# EAGLE design S4QX11 (EAGLE 7.5.0)
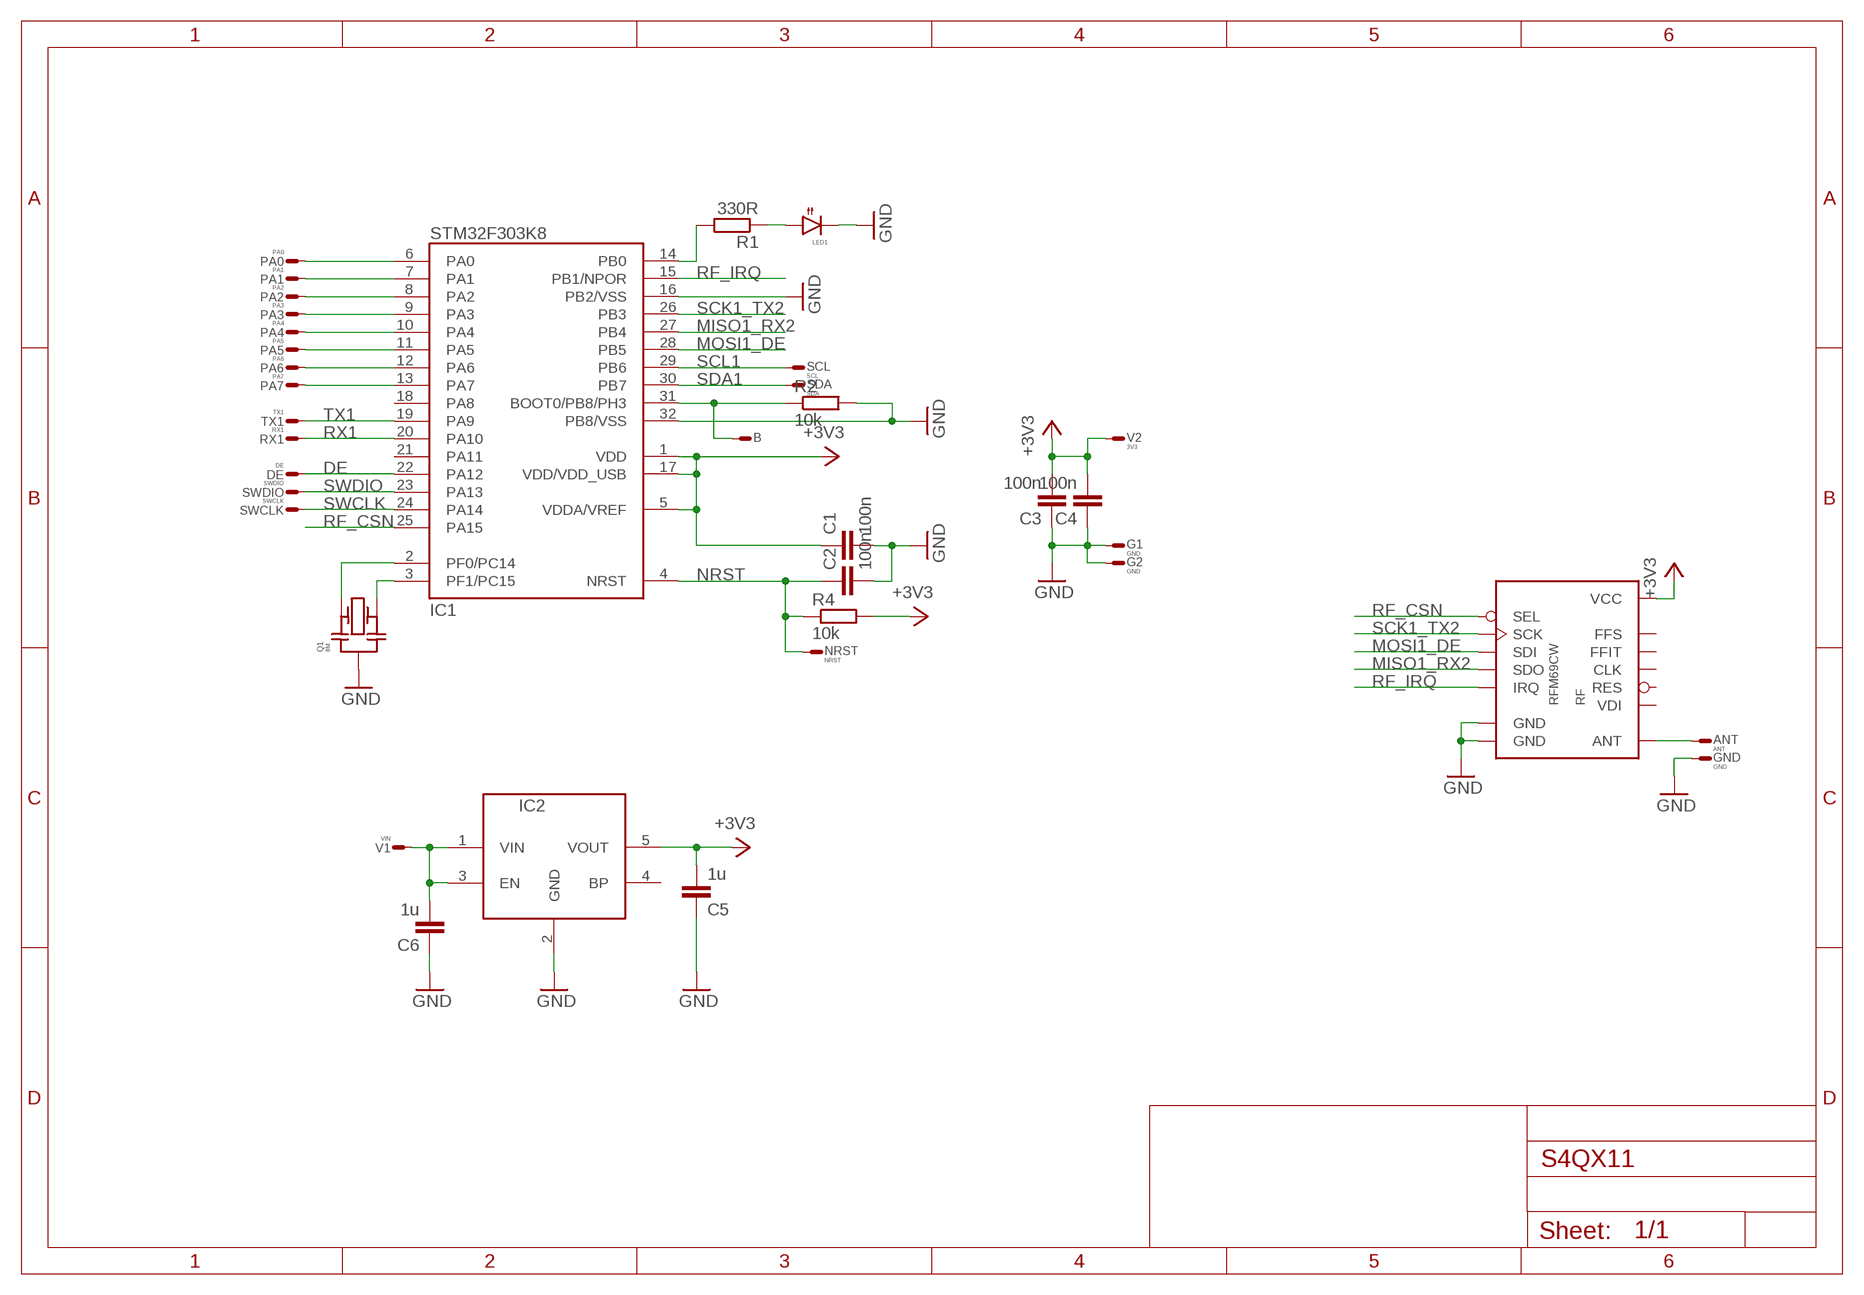
[diagram p0: schematic, sheet 1]

## Parts
ANT  ANT  WIREPADT1.6/0.9  [T1.6/0.9]
B  WIREPADR  [S1.27R]
C1  100n  C0603  [0603]
C2  100n  C0603  [0603]
C3  100n  C0603  [0603]
C4  100n  C0603  [0603]
C5  1u  C0603  [0603]
C6  1u  C0603  [0603]
DE  DE  WIREPADT1.6/0.9  [T1.6/0.9]
G1  GND  WIREPADT1.6/0.9  [T1.6/0.9]
G2  GND  WIREPADT1.6/0.9  [T1.6/0.9]
GND  GND  WIREPADT1.6/0.9  [T1.6/0.9]
IC1  STM32F303K8  STM32_LQFP32  [LQFP32-7X7]
IC2  LDO  [SOT23-5]
LED1  LED1206  [1206]
NRST  NRST  WIREPADT1.6/0.9  [T1.6/0.9]
PA0  PA0  WIREPADT1.6/0.9  [T1.6/0.9]
PA1  PA1  WIREPADT1.6/0.9  [T1.6/0.9]
PA2  PA2  WIREPADT1.6/0.9  [T1.6/0.9]
PA3  PA3  WIREPADT1.6/0.9  [T1.6/0.9]
PA4  PA4  WIREPADT1.6/0.9  [T1.6/0.9]
PA5  PA5  WIREPADT1.6/0.9  [T1.6/0.9]
PA6  PA6  WIREPADT1.6/0.9  [T1.6/0.9]
PA7  PA7  WIREPADT1.6/0.9  [T1.6/0.9]
Q1  8M  QRCE  [CSTCE]
R1  330R  R0603  [0603]
R2  10k  R0603  [0603]
R4  10k  R0603  [0603]
RF  RFM69CW  RFM12B-868-S1  [RFM12B]
RX1  RX1  WIREPADT1.6/0.9  [T1.6/0.9]
SCL  SCL  WIREPADT1.6/0.9  [T1.6/0.9]
SDA  SDA  WIREPADT1.6/0.9  [T1.6/0.9]
SWCLK  SWCLK  WIREPADT1.6/0.9  [T1.6/0.9]
SWDIO  SWDIO  WIREPADT1.6/0.9  [T1.6/0.9]
TX1  TX1  WIREPADT1.6/0.9  [T1.6/0.9]
V1  VIN  WIREPADT1.6/0.9  [T1.6/0.9]
V2  3V3  WIREPADT1.6/0.9  [T1.6/0.9]

## Nets
+3V3: C1.1 C3.2 C4.2 C5.2 IC1.1(VDD) IC1.5(VDDA/VREF) IC1.17(VDD/VDD_USB) IC2.5(VOUT) R4.2 RF.VDD(VCC) V2.1(S)
DE: DE.1(S) IC1.22(PA12)
GND: C1.2 C2.2 C3.1 C4.1 C5.1 C6.1 G1.1(S) G2.1(S) GND.1(S) IC1.16(PB2/VSS) IC1.32(PB8/VSS) IC2.2(GND) LED1.2(C) Q1.G(M) R2.2 RF.GND RF.GND@1(GND)
MISO1_RX2: IC1.27(PB4) RF.SDO
MOSI1_DE: IC1.28(PB5) RF.SDI
N$1: ANT.1(S) RF.ANT
N$2: IC1.3(PF1/PC15) Q1.B
N$3: IC1.6(PA0) PA0.1(S)
N$4: B.1(S) IC1.31(BOOT0/PB8/PH3) R2.1
N$5: IC1.2(PF0/PC14) Q1.A
N$6: IC1.7(PA1) PA1.1(S)
N$7: IC1.8(PA2) PA2.1(S)
N$8: IC1.9(PA3) PA3.1(S)
N$9: IC1.10(PA4) PA4.1(S)
N$10: IC1.11(PA5) PA5.1(S)
N$11: IC1.12(PA6) PA6.1(S)
N$12: IC1.13(PA7) PA7.1(S)
N$13: IC1.14(PB0) R1.2
N$14: LED1.1(A) R1.1
N$15: C6.2 IC2.1(VIN) IC2.3(EN) V1.1(S)
NRST: C2.1 IC1.4(NRST) NRST.1(S) R4.1
RF_CSN: IC1.25(PA15) RF.SEL
RF_IRQ: IC1.15(PB1/NPOR) RF.IRQ
RX1: IC1.20(PA10) RX1.1(S)
SCK1_TX2: IC1.26(PB3) RF.SCK
SCL1: IC1.29(PB6) SCL.1(S)
SDA1: IC1.30(PB7) SDA.1(S)
SWCLK: IC1.24(PA14) SWCLK.1(S)
SWDIO: IC1.23(PA13) SWDIO.1(S)
TX1: IC1.19(PA9) TX1.1(S)
Unconnected: IC1.18(PA8) IC1.21(PA11) IC2.4(BP) RF./RES(RES) RF.CFIL(FFIT) RF.CLK RF.FFS RF.INT(VDI)

## Library data of the parts
ANT B DE G1 G2 GND NRST PA0 PA1-PA7 RX1 SCL SDA SWCLK SWDIO TX1 V1 V2 = Conn:WIREPAD: Wire PAD connect wire on PCB
C1-C6 = RCL:C: Capacitor SMD
IC1 = STM32:STM32_LQFP32
IC2 = DCDC:LDO
LED1 = Optic:LED
Q1 = QUARTZ:QR
R1 R2 R4 = RCL:R: Resistor SMD
RF = RF:RFM12B: 5dB Transceiver Module

## Board
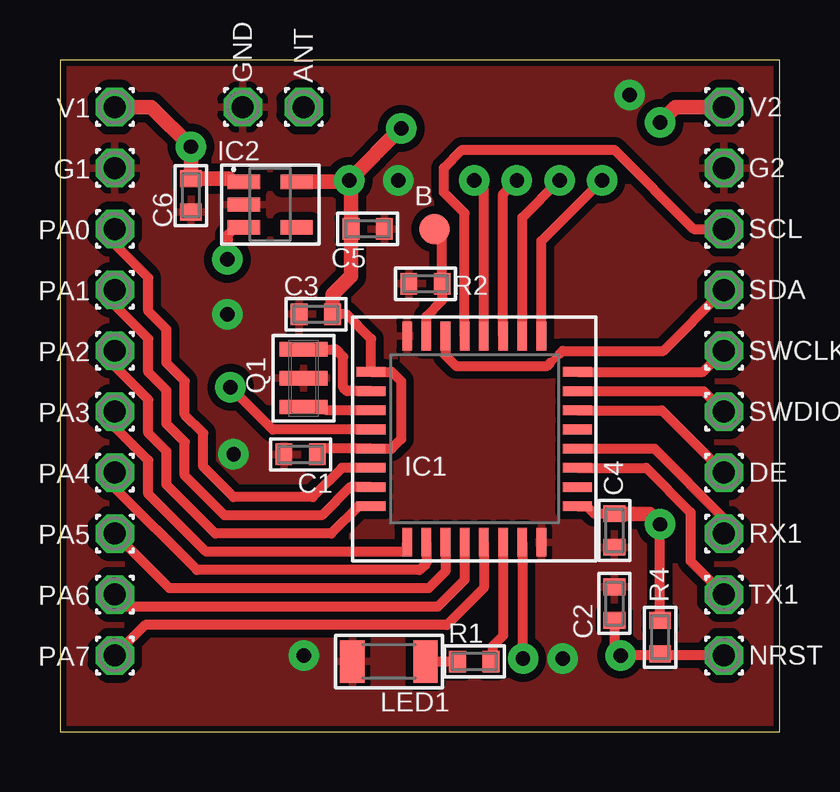
[diagram p1: board, top side]
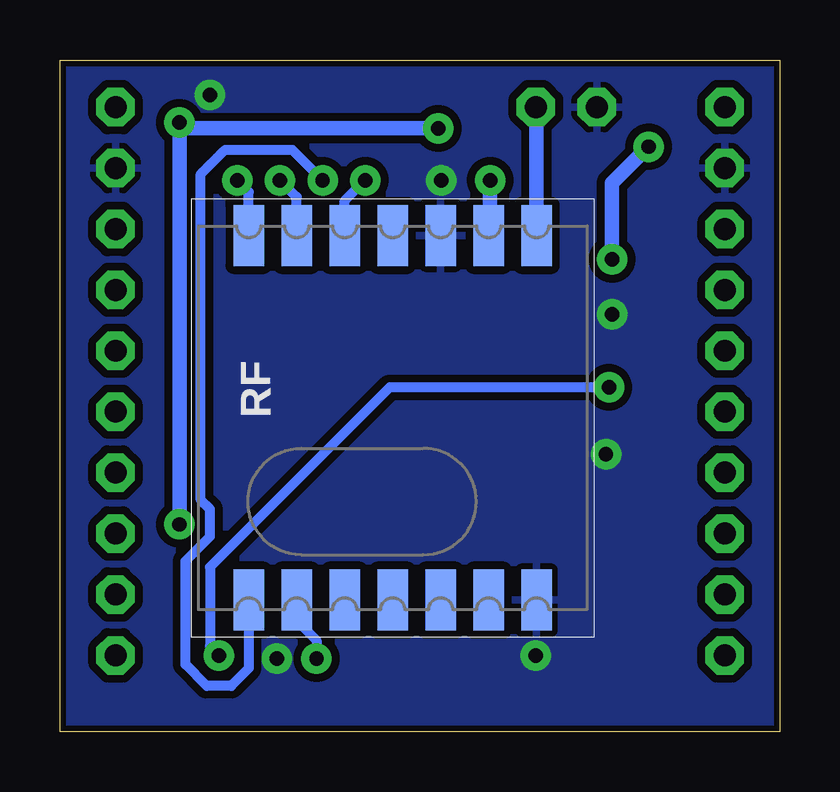
[diagram p2: board, bottom side, seen from below]

Size 30 x 28 mm. Coordinates in mm from the lower left corner, seen from the top.
Outline: 0,0 30,0 30,28 0,28 0,0
Copper layers (1*16): Top 0.035mm / dielectric 1.5mm / Bottom 0.035mm
Design rules "default *": minimum track width 12mil, minimum drill 12mil, track to track 13mil, track to pad 13mil, pad to pad 13mil, via to via 13mil, smd to smd 13mil, copper to edge 10mil, drill to drill 8mil, minimum pad ring 10mil, minimum via ring 8mil, stop-mask expansion 2mil, vias tented up to drill 24mil, thermal gap 10mil

### Footprints (pad centres in the part's own frame; a part is rotated, then mirrored left to right if it is on the bottom)
T1.6/0.9 = drill 0.914 pad 1.6 octagon: 1 0,0
S1.27R = smd 1.27 x 1.27: 1 0,0
0603 = smd 0.7 x 0.9: 1 -0.697,0; 2 0.697,0
LQFP32-7X7 = smd 1.2 x 0.4: 1 -4.3,2.8; 2 -4.3,2; 3 -4.3,1.2; 4 -4.3,0.4; 5 -4.3,-0.4; 6 -4.3,-1.2; 7 -4.3,-2; 8 -4.3,-2.8; 17 4.3,-2.8; 18 4.3,-2; 19 4.3,-1.2; 20 4.3,-0.4; 21 4.3,0.4; 22 4.3,1.2; 23 4.3,2; 24 4.3,2.8 | smd 0.4 x 1.2: 9 -2.8,-4.3; 10 -2,-4.3; 11 -1.2,-4.3; 12 -0.4,-4.3; 13 0.4,-4.3; 14 1.2,-4.3; 15 2,-4.3; 16 2.8,-4.3; 25 2.8,4.3; 26 2,4.3; 27 1.2,4.3; 28 0.4,4.3; 29 -0.4,4.3; 30 -1.2,4.3; 31 -2,4.3; 32 -2.8,4.3
SOT23-5 = smd 0.6 x 1.35: 1 -0.95,-1.101; 2 0,-1.101; 3 0.95,-1.101; 4 0.95,1.101; 5 -0.951,1.101
1206 = smd 1.016 x 1.778: 1 -1.524,0; 2 1.524,0
CSTCE = smd 0.6 x 2: A -1.2,0; B 1.2,0; G 0,0
RFM12B = smd 2.54 x 1.27: /RES -7.6,-4; ANT 7.6,-6; CFIL -7.6,0; CLK -7.6,-2; FFS -7.6,2; GND 7.6,-2; GND@1 -7.6,-6; INT 7.6,0; IRQ -7.6,4; SCK 7.6,4; SDI 7.6,2; SDO -7.6,6; SEL 7.6,6; VDD 7.6,-4

### Placement (x,y rotation side)
ANT  10.16,26.04 90 top
B  15.62,20.95 0 top
C1  10.03,11.56 180 top
C2  23.11,5.33 90 top
C3  10.67,17.4 0 top
C4  23.11,8.38 90 top
C5  12.83,20.95 180 top
C6  5.46,22.35 90 top
DE  27.69,10.79 0 top
G1  2.29,23.5 180 top
G2  27.69,23.5 0 top
GND  7.62,26.04 90 top
IC1  17.27,12.19 0 top
IC2  8.76,21.97 270 top
LED1  13.72,2.92 180 top
NRST  27.69,3.17 0 top
PA0  2.29,20.95 180 top
PA1  2.29,18.41 180 top
PA2  2.29,15.88 180 top
PA3  2.29,13.34 180 top
PA4  2.29,10.79 180 top
PA5  2.29,8.26 180 top
PA6  2.29,5.71 180 top
PA7  2.29,3.17 180 top
Q1  10.16,14.73 270 top
R1  17.27,2.92 0 top
R2  15.24,18.67 180 top
R4  25.02,3.94 90 top
RF  16.13,13.08 90 bottom
RX1  27.69,8.26 0 top
SCL  27.69,20.95 0 top
SDA  27.69,18.41 0 top
SWCLK  27.69,15.88 0 top
SWDIO  27.69,13.34 0 top
TX1  27.69,5.71 0 top
V1  2.29,26.04 180 top
V2  27.69,26.04 0 top

### Tracks (layer width: path | path; a pad name or v marks a point on that pad's centre or on a via)
+3V3  (via drill 0.6 pad 1.27)
  Top 0.406: R4.2 v25.02,8.64 | C1.1 10.96,11.79 IC1.5 13.82,11.79 14.22,12.19 14.22,14.61 13.84,14.99 IC1.1 12.97,16.36 11.94,17.4 C3.2 | IC1.17 21.98,9.39 22.29,9.08 C4.2 | 12,22.92 v12.06,22.99
  Top 0.61: V2.1 25.65,26.04 v25.02,25.4 | C4.2 24.58,9.08 v25.02,8.64 | C3.2 11.37,18.22 12.13,18.99 C5.2 12.13,22.92 v12.06,22.99 v14.22,25.15 | IC2.5 12,22.92
  Bottom 0.61: 25.02,25.15 v25.02,8.64 | v12.06,22.99 12.06,20.75 RF.VDD | v25.02,25.4 25.02,25.15 | 25.02,25.15 v14.22,25.15
DE
  Top 0.406: DE.1 25.09,13.39 IC1.22
GND  (via drill 0.6 pad 1.27)
  other vias: 23.75,26.54 14.1,22.99 10.16,3.17 7.24,11.56 6.99,17.4 20.95,3.05
  pour Top: 0,0 30,0 30,28 0,28
  pour Bottom: 0,0 30,0 30,28 0,28
MISO1_RX2  (via drill 0.6 pad 1.27)
  Top 0.406: IC1.27 18.47,22.41 v19.05,22.99
  Bottom 0.406: v19.05,22.99 20.32,24.26 23.11,24.26 24.13,23.24 24.13,9.65 23.75,9.27 23.75,8.13 24.77,7.11 24.77,2.79 23.88,1.91 22.86,1.91 22.13,2.64 RF.SDO
MOSI1_DE  (via drill 0.6 pad 1.27)
  Top 0.406: IC1.28 17.67,22.59 v17.27,22.99
  Bottom 0.406: RF.SDI 18.13,22.13 v17.27,22.99
N$1
  Bottom 0.61: RF.ANT 10.13,26 ANT.1
N$2
  Top 0.406: IC1.3 11.12,13.39 10.98,13.53 Q1.B
N$3
  Top 0.406: PA0.1 2.29,20.32 3.68,18.92 3.68,17.53 4.45,16.76 4.45,15.37 5.21,14.61 5.21,13.21 5.97,12.45 5.97,11.05 7.24,9.78 10.54,9.78 11.75,10.99 IC1.6
N$4
  Top 0.406: IC1.31 15.27,17.3 15.94,17.97 R2.1 15.94,20.64 B.1
N$5
  Top 0.406: IC1.2 11.97,14.19 11.81,14.35 11.81,15.62 11.5,15.93 Q1.A
N$6
  Top 0.406: PA1.1 2.29,17.78 3.68,16.38 3.68,14.99 4.45,14.22 4.45,12.83 5.21,12.06 5.21,10.67 6.86,9.02 10.92,9.02 12.1,10.19 IC1.7
N$7
  Top 0.406: PA2.1 2.29,15.24 3.68,13.84 3.68,12.45 4.45,11.68 4.45,10.29 6.48,8.26 11.3,8.26 12.44,9.39 IC1.8
N$8
  Top 0.406: PA3.1 2.29,12.7 3.68,11.3 3.68,9.91 6.1,7.49 14.47,7.49 IC1.9
N$9
  Top 0.406: IC1.10 15.27,7.02 14.99,6.73 5.71,6.73 2.29,10.16 PA4.1
N$10
  Top 0.406: IC1.11 16.07,6.67 15.37,5.97 4.57,5.97 PA5.1
N$11
  Top 0.406: IC1.12 16.87,6.33 15.75,5.21 2.79,5.21 PA6.1
N$12
  Top 0.406: IC1.13 17.67,5.99 16.13,4.45 3.56,4.45 PA7.1
N$13
  Top 0.406: IC1.14 18.47,3.99 18.03,3.56 18.03,2.99 R1.2
N$14
  Top 0.406: LED1.1 R1.1
N$15  (via drill 0.6 pad 1.27)
  Top 0.406: IC2.1 7.18,22.92 7.11,22.99 | IC2.3 7.3,21.02 6.99,20.7 v6.99,19.68
  Top 0.61: V1.1 3.81,26.04 v5.46,24.38 C6.2 7.05,23.05 7.11,22.99
  Bottom 0.61: v5.46,24.38 6.99,22.86 v6.99,19.68
NRST  (via drill 0.6 pad 1.27)
  Top 0.406: IC1.4 8.87,12.59 v7.11,14.35 | R4.1 25.02,3.17 | 25.02,3.17 v23.37,3.17 23.11,3.43 C2.1 | NRST.1 25.02,3.17
  Bottom 0.406: v7.11,14.35 16.26,14.35 23.75,6.86 23.75,3.56 v23.37,3.17
RF_CSN  (via drill 0.6 pad 1.27)
  Top 0.406: IC1.25 20.07,20.45 v22.61,22.99
  Bottom 0.406: RF.SEL 22.13,22.51 v22.61,22.99
RF_IRQ  (via drill 0.6 pad 1.27)
  Top 0.406: IC1.15 19.27,3.08 v19.3,3.05
  Bottom 0.406: RF.IRQ 20.07,5.42 20.07,4.57 19.3,3.81 v19.3,3.05
RX1
  Top 0.406: RX1.1 27.69,8.89 24.78,11.79 IC1.20
SCK1_TX2  (via drill 0.6 pad 1.27)
  Top 0.406: IC1.26 19.27,21.43 v20.83,22.99
  Bottom 0.406: RF.SCK 20.13,22.29 v20.83,22.99
SCL1
  Top 0.406: IC1.29 16.87,21.61 16,22.48 16,23.5 16.76,24.26 23.11,24.26 26.42,20.95 SCL.1
SDA1
  Top 0.305: 20.45,15.37 20.83,15.75
  Top 0.406: IC1.30 16.07,15.68 16.51,15.24 20.32,15.24 20.45,15.37 | 20.83,15.75 20.95,15.88 25.15,15.88 SDA.1
SWCLK
  Top 0.406: IC1.24 26.8,14.99 SWCLK.1
SWDIO
  Top 0.406: IC1.23 26.83,14.19 SWDIO.1
TX1
  Top 0.406: TX1.1 26.29,7.11 26.29,9.14 24.44,10.99 IC1.19